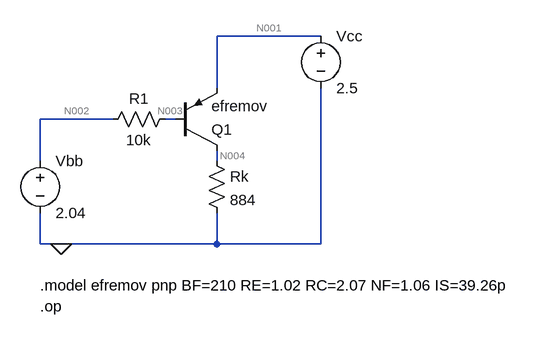
[diagram p0: schematic 2a.asc]
2a.asc, the LTspice schematic file:
Version 4
SHEET 1 880 680
WIRE 384 48 224 48
WIRE 224 128 224 48
WIRE 64 176 -48 176
WIRE 160 176 144 176
WIRE -48 240 -48 176
WIRE 224 240 224 224
WIRE -48 368 -48 320
WIRE -16 368 -48 368
WIRE 224 368 224 320
WIRE 224 368 -16 368
WIRE 384 368 384 128
WIRE 384 368 224 368
FLAG -16 368 0
SYMBOL pnp 160 224 M180
SYMATTR InstName Q1
SYMATTR Value efremov
SYMBOL voltage 384 32 R0
WINDOW 123 0 0 Left 0
WINDOW 39 0 0 Left 0
SYMATTR InstName Vcc
SYMATTR Value 2.5
SYMBOL res 160 160 R90
WINDOW 0 0 56 VBottom 2
WINDOW 3 32 56 VTop 2
SYMATTR InstName R1
SYMATTR Value 10k
SYMBOL res 208 224 R0
SYMATTR InstName Rk
SYMATTR Value 884
SYMBOL voltage -48 224 R0
WINDOW 123 0 0 Left 0
WINDOW 39 0 0 Left 0
SYMATTR InstName Vbb
SYMATTR Value 2.04
TEXT -48 432 Left 2 !.model efremov pnp BF=210 RE=1.02 RC=2.07 NF=1.06 IS=39.26p
TEXT -48 464 Left 2 !.op

The netlist it stands for:
* 2a.asc
Q1 N004 N003 N001 0 efremov
Vcc N001 0 2.5
R1 N003 N002 10k
Rk N004 0 884
Vbb N002 0 2.04
.model NPN NPN
.model PNP PNP
.lib standard.bjt
.model efremov pnp BF=210 RE=1.02 RC=2.07 NF=1.06 IS=39.26p
.op
.backanno
.end

* Results of the author's LTspice run, read from the files saved beside the schematic
* Operating Point:
*   V(n004) = 339.6 mV
*   V(n003) = 2.058 V
*   V(n001) = 2.5 V
*   V(n002) = 2.04 V
*   Ic(Q1) = -384.2 µA
*   Ib(Q1) = -1.829 µA
*   Ie(Q1) = 386 µA
*   I(Rk) = 384.2 µA
*   I(R1) = 1.829 µA
*   I(Vbb) = 1.829 µA
*   I(Vcc) = -386 µA
* From the log:
*   Semiconductor Device Operating Points:
*                           --- Bipolar Transistors ---
*   Name:       q1
*   Model:    efremov
*   Ib:      -1.83e-06
*   Ic:      -3.84e-04
*   Vbe:     -4.42e-01
*   Vbc:      1.72e+00
*   Vce:     -2.16e+00
*   BetaDC:   2.10e+02
*   Gm:       1.40e-02
*   Rpi:      1.50e+04
*   Rx:       0.00e+00
*   Ro:       4.61e+37
*   Cbe:      0.00e+00
*   Cbc:      0.00e+00
*   Cjs:      0.00e+00
*   BetaAC:   2.10e+02
*   Cbx:      0.00e+00
*   Ft:       0.00e+00